# EAGLE schematic vdg_voltage_sensor (EAGLE 9.6.2)
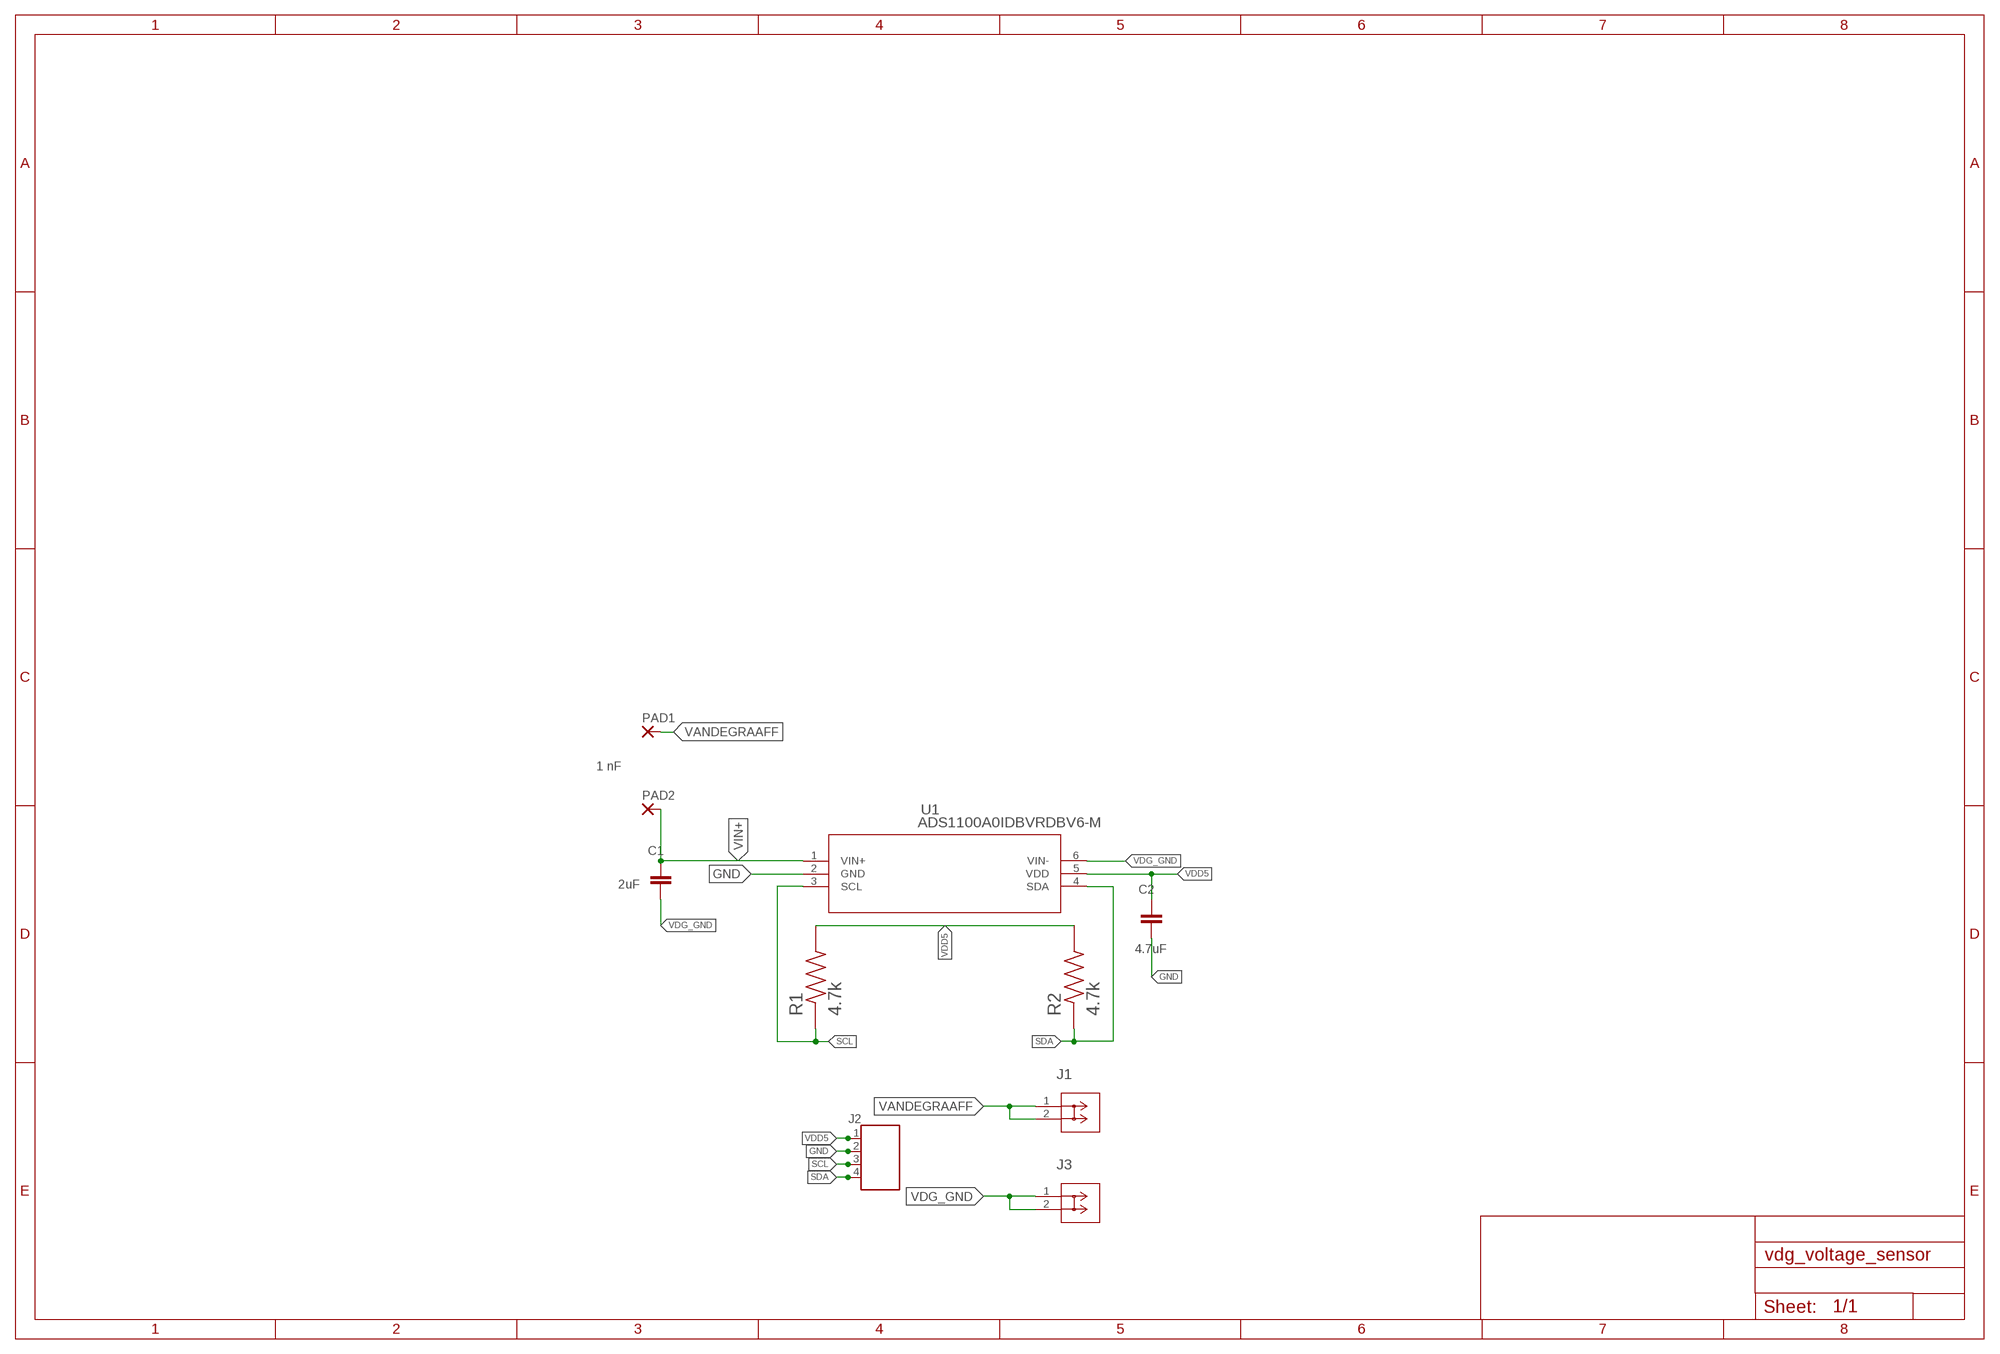
[diagram p0: schematic, sheet 1]

## Parts
C1  2uF  GRM31CR60J107ME39L  [CAP_1206]
C2  4.7uF  GRM31CR60J107ME39L  [CAP_1206]
J1  VANDEGRAAFF  SR99S01VBNN00G7  [SR99S01VBNN00G7_MZC]
J2  691131710004  [691131710004]
J3  SR99S01VBNN00G7  [SR99S01VBNN00G7_MZC]
PAD1  1,6/0,9  [1,6/0,9]
PAD2  1,6/0,9  [1,6/0,9]
R1  4.7k  CRGP1206F120R  [RESC3115X65N]
R2  4.7k  CRGP1206F120R  [RESC3115X65N]
U1  ADS1100A0IDBVRDBV6-M  [DBV6-M]

## Nets
GND: C2.2 J2.2 U1.2(GND)
SCL: J2.3 R1.1 U1.3(SCL)
SDA: J2.4 R2.1 U1.4(SDA)
VANDEGRAAFF: J1.1 J1.2 PAD1.1(P)
VDD5: C2.1 J2.1 R1.2 R2.2 U1.5(VDD)
VDG_GND: C1.2 J3.1 J3.2 U1.6(VIN-)
VIN+: C1.1 PAD2.1(P) U1.1(VIN+)

## Notes on the sheet
- 1 nF

## Library data of the parts
C1 C2 = Resistor_Capacitor:GRM31CR60J107ME39L: CAP CER 100UF 6.3V X5R 1206 Manufacturer's datasheet <https://www.murata.com/~/media/webrenewal/support/library/catalog/products/capacitor/mlcc/c02e.ashx?la=en-us>; CREATED_BY: PCBLayout.com; DIGIKEY_PART_NUMBER: GRM31CR60J107ME39L; MANUFACTURER: Murata Electronics North America; MPN: GRM31CR60J107ME39L; PACKAGE: SMD 1206
J1 J3 = screwterm_1:SR99S01VBNN00G7; BUILT_BY: EMA_Kyle; COPYRIGHT: Copyright (C) 2018 Accelerated Designs. All rights reserved; MANUFACTURER_PART_NUMBER: SR99S01VBNN00G7; SOURCELIBRARY: Metz_Connect_USA_2019-05-03; VENDOR: Metz Connect USA
J2 = Wurth_Elektronik_Electromechanic_Terminal_Blocks_Connectors_rev16b:691131710004: WR-TBL Terminal block - CUU5/4 - 4 Pins;=>Code : Con_TBL_Screw_PClamp_5.00_6911317100xx_691131710004 <http://katalog.we-online.de/media/images/eican/Con_TBL_Screw_PClamp_5.00_6911317100xx_pf2.jpg> Details see: http://katalog.we-online.de/em/datasheet/6911317100xx.pdf Created 11/3/2014, Karrer Zheng 2014 (C) Wurth Elektronik
PAD1 PAD2 = wirepad:1,6/0,9: THROUGH-HOLE PAD
R1 R2 = CRGP1206F120R:CRGP1206F120R: Fixed Resistor CRGP 1206 120R 1%; ARROW_ELECTRONICS-PURCHASE-URL: https://snapeda.com/shop?store=Arrow+Electronics&id=3188205; AVAILABILITY: Unavailable; COMMENT: 1-2176328-4; DESCRIPTION: Fixed Resistor CRGP 1206 120R 1%; DIGIKEY-PURCHASE-URL: https://snapeda.com/shop?store=DigiKey&id=3188205; MF: TE Connectivity; MOUSER-PURCHASE-URL: https://snapeda.com/shop?store=Mouser&id=3188205; MP: CRGP1206F120R; PACKAGE: 3115 TE Connectivity; PRICE: None
U1 = ADS1100:ADS1100A0IDBVR; DATASHEET_URL: http://www.ti.com/lit/gpn/ADS1100; DESCRIPTION: Self-Calibrating, 16-Bit Analog-to-Digital Converter; FAMILY_NAME: PRECISION ADC (<=10MSPS); GENERIC_PART_NUMBER: ADS1100; INDUSTRY_STD_PKG_TYPE: SOT-23; MANUFACTURER: Texas Instruments; PACKAGE_DESIGNATOR: DBV; PIN_COUNT: 6